# EAGLE design adapt_uart_serie (EAGLE 5.06)
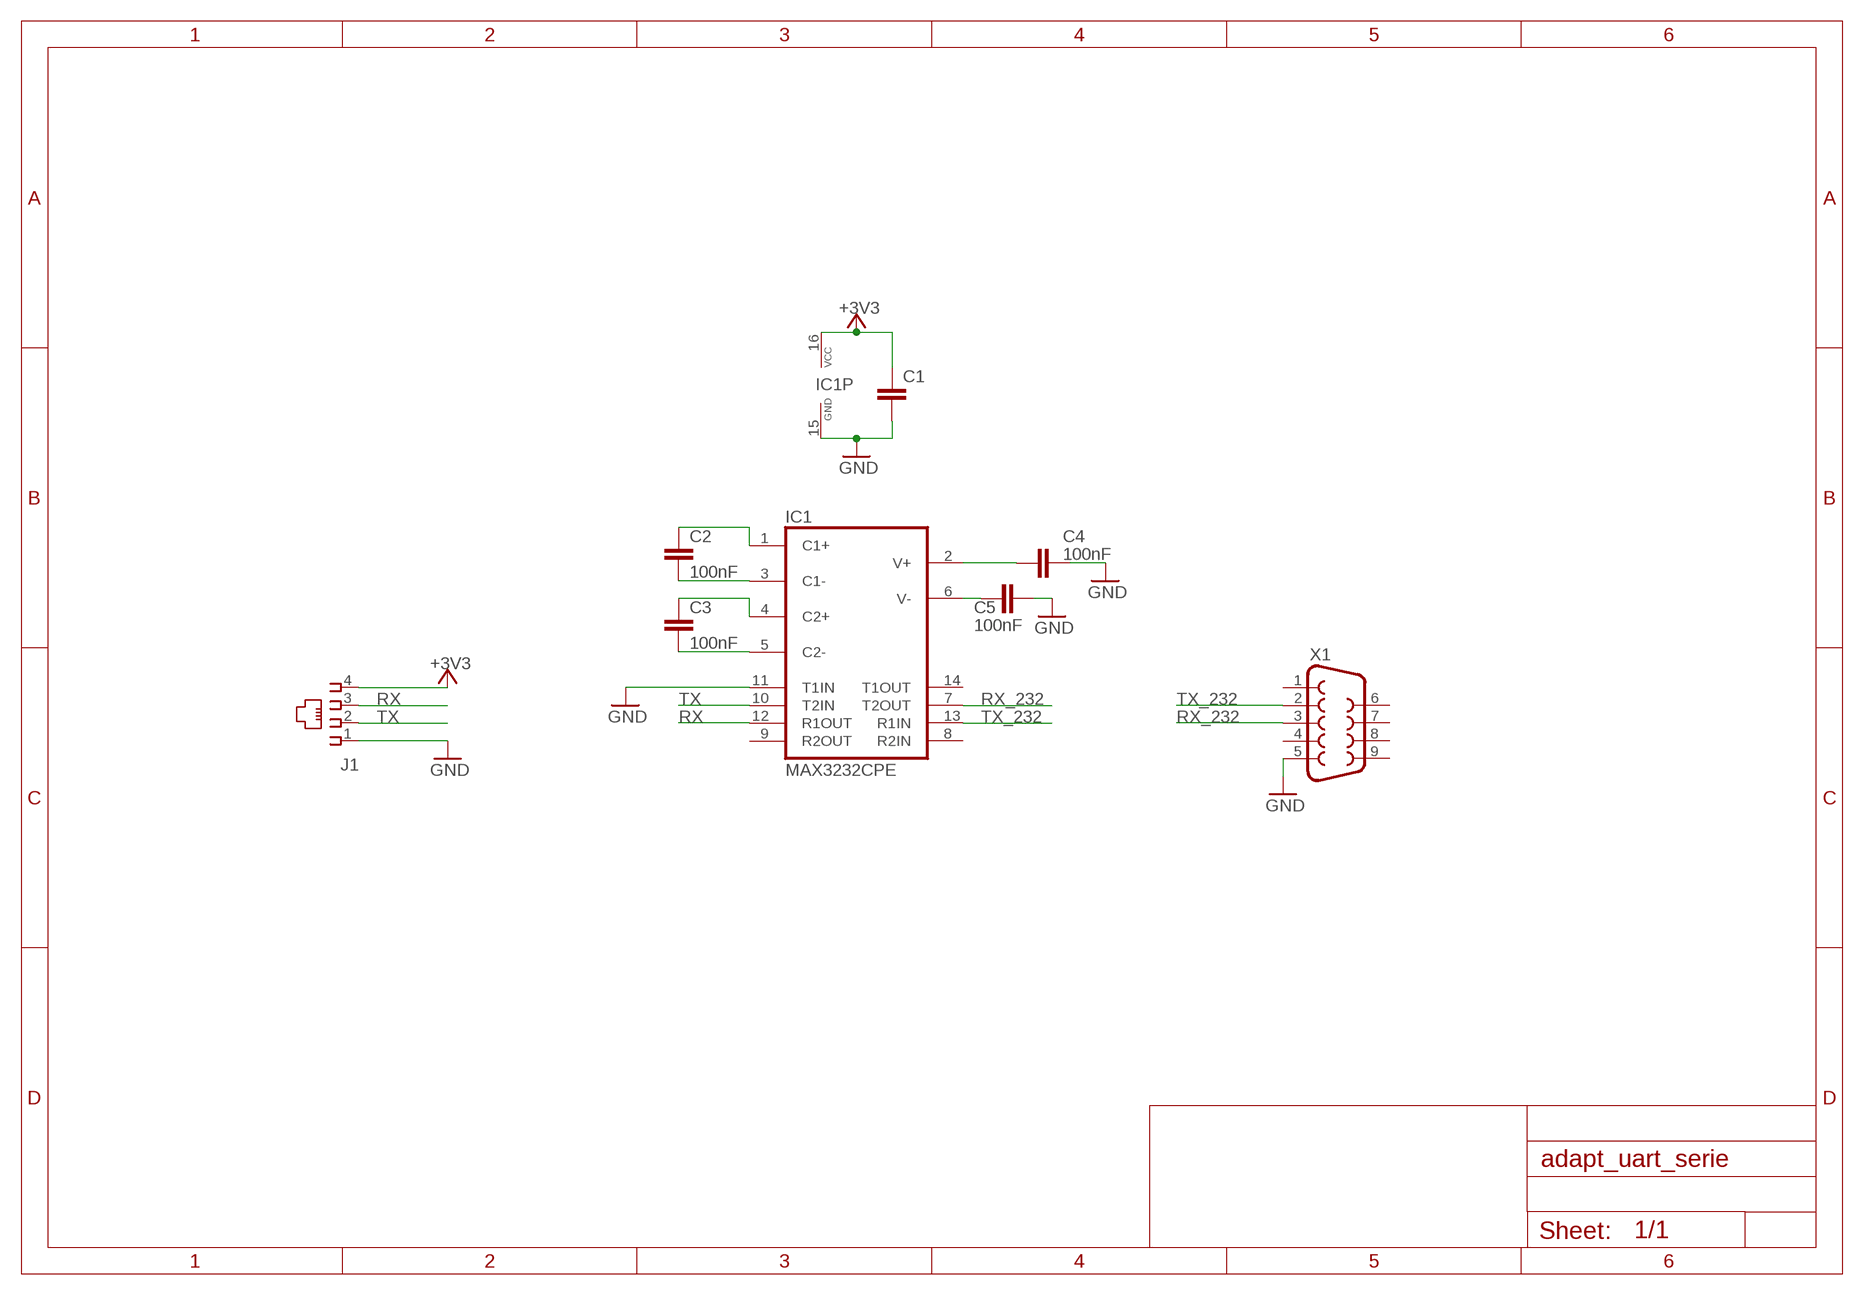
[diagram p0: schematic, sheet 1]

## Parts
C1  C-EUC0805  [C0805]
C2  100nF  C-EUC0805  [C0805]
C3  100nF  C-EUC0805  [C0805]
C4  100nF  C-EU025-025X050  [C025-025X050]
C5  100nF  C-EU025-024X044  [C025-024X044]
IC1  MAX3232CPE  [DIL16]
J1  520257-2  [520257-2]
X1  F09D  [F09D]

## Nets
+3V3: C1.1 IC1.16(VCC) J1.4
GND: C1.2 C4.2 C5.2 IC1.11(T1IN) IC1.15(GND) J1.1 X1.5
N$1: C5.1 IC1.6(V-)
N$2: C4.1 IC1.2(V+)
N$5: C3.1 IC1.4(C2+)
N$6: C3.2 IC1.5(C2-)
N$7: C2.2 IC1.3(C1-)
N$8: C2.1 IC1.1(C1+)
RX: IC1.12(R1OUT) J1.3
RX_232: IC1.7(T2OUT) X1.3
TX: IC1.10(T2IN) J1.2
TX_232: IC1.13(R1IN) X1.2
Unconnected: IC1.8(R2IN) IC1.9(R2OUT) IC1.14(T1OUT) X1.1 X1.4 X1.6 X1.7 X1.8 X1.9

## Library data of the parts
C1-C5 = rcl:C-EU: CAPACITOR, European symbol
IC1 = maxim:MAX3232*: True RS-232 Transceivers 3.0V to 5.5V, Low-Power up to 1Mbps, Using Four 0.1µF External Capacitors Source: http://pdfserv.maxim-ic.com/en/ds/MAX3222-MAX3241.pdf
J1 = con-amp:520257-2: AMP connector
X1 = con-subd:F09: SUB-D

## Board
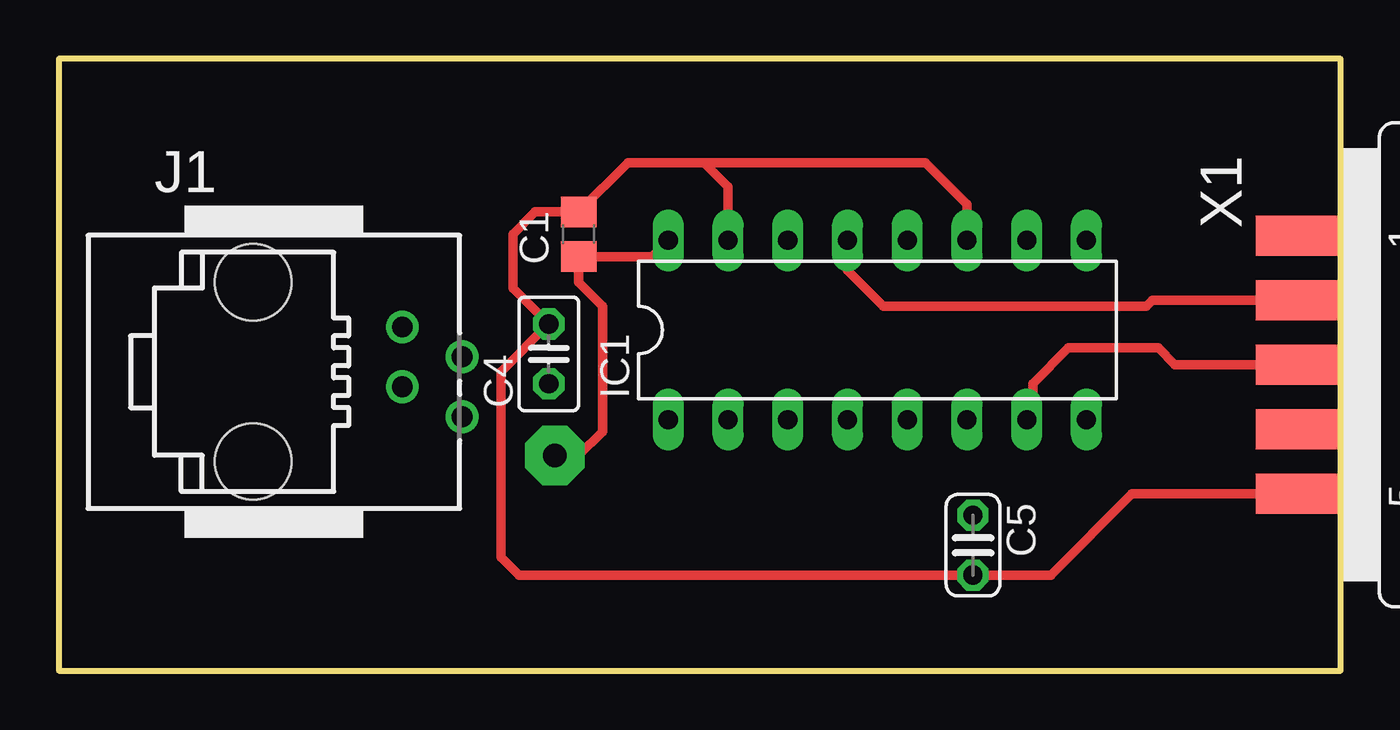
[diagram p1: board, top side]
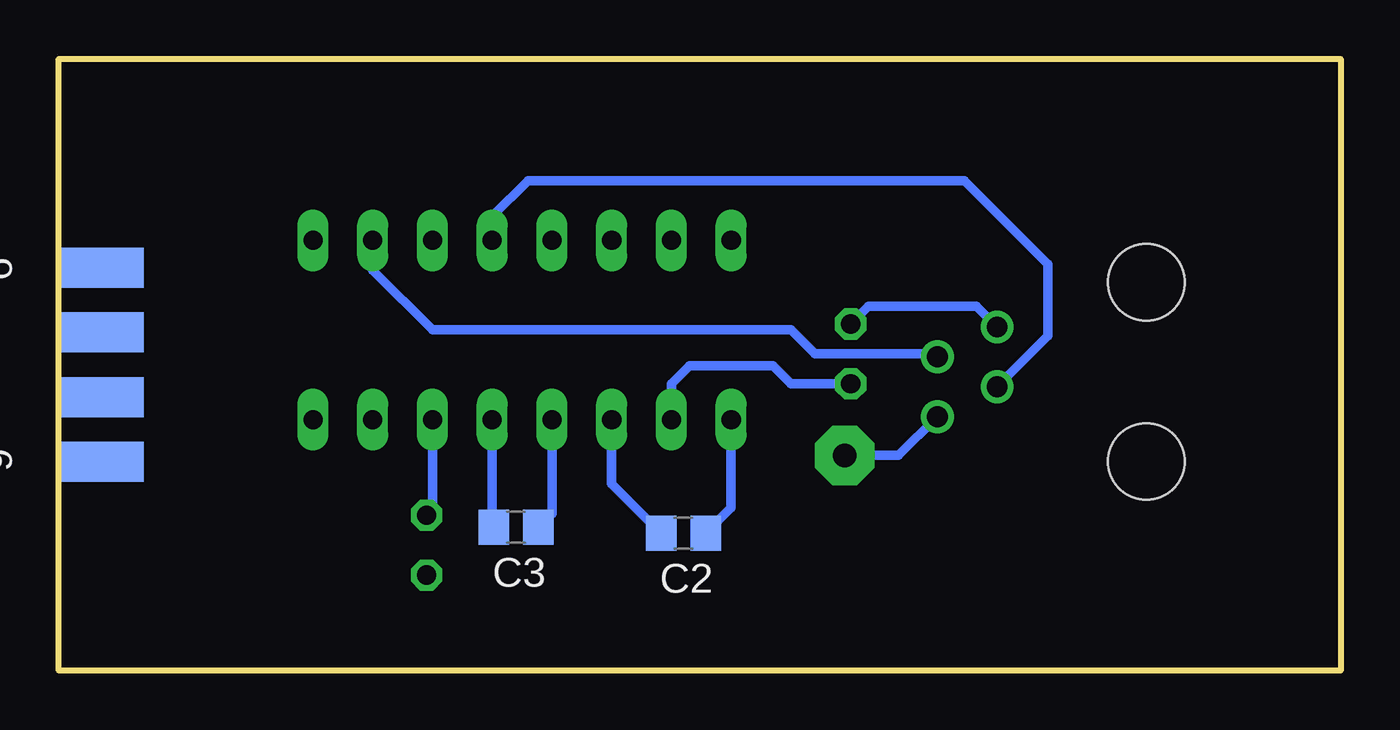
[diagram p2: board, bottom side, seen from below]

Size 54.49 x 26 mm. Coordinates in mm from the lower left corner, seen from the top.
Outline: 0,0 54.49,0 54.49,26 0,26 0,0
Copper layers (1*16): Top 0.035mm / dielectric 1.5mm / Bottom 0.035mm
Design rules "default *": minimum track width 10mil, minimum drill 24mil, track to track 0.4mm, track to pad 0.4mm, pad to pad 0.4mm, via to via 0.4mm, smd to smd 8mil, copper to edge 1mm, drill to drill 8mil, minimum pad ring 10mil, minimum via ring 8mil, stop-mask expansion 4mil, vias tented up to drill 0mil, thermal gap 10mil

### Footprints (pad centres in the part's own frame; a part is rotated, then mirrored left to right if it is on the bottom)
C0805 = smd 1.3 x 1.5: 1 -0.95,0; 2 0.95,0
C025-025X050 = drill 0.813 octagon: 1 -1.27,0; 2 1.27,0
C025-024X044 = drill 0.813 octagon: 1 -1.27,0; 2 1.27,0
DIL16 = drill 0.813 long: 1 -8.89,-3.81; 2 -6.35,-3.81; 3 -3.81,-3.81; 4 -1.27,-3.81; 5 1.27,-3.81; 6 3.81,-3.81; 7 6.35,-3.81; 8 8.89,-3.81; 9 8.89,3.81; 10 6.35,3.81; 11 3.81,3.81; 12 1.27,3.81; 13 -1.27,3.81; 14 -3.81,3.81; 15 -6.35,3.81; 16 -8.89,3.81
520257-2 = drill 0.889 round: 1 -1.905,5.461; 2 -0.635,8.001; 3 0.635,5.461; 4 1.905,8.001 | hole 3.251: -3.81,-0.889; 3.81,-0.889
F09D = smd 1.7 x 3.5: 1 -5.486,-6.045; 2 -2.743,-6.045; 3 0,-6.045; 4 2.743,-6.045; 5 5.486,-6.045 | smd 1.7 x 3.5 bottom: 6 -4.115,-6.045; 7 -1.372,-6.045; 8 1.372,-6.045; 9 4.115,-6.045

### Placement (x,y rotation side)
C1  22.1,18.54 90 top
C2  27.94,5.84 180 bottom
C3  35.05,6.1 180 bottom
C4  20.83,13.46 90 top
C5  38.86,5.33 270 top
IC1  34.8,14.48 0 top
J1  9.14,12.7 270 top
X1  58.67,13 270 top

### Tracks (layer width: path | path; a pad name or v marks a point on that pad's centre or on a via)
+3V3  (via drill 1 pad 2.54)
  Top 0.406: v21.08,9.14 22.1,9.14 23.11,10.16 23.11,15.49 22.1,16.51 C1.1 25.21,17.59 IC1.16
  Bottom 0.406: v21.08,9.14 18.8,9.14 J1.4
GND
  Top 0.406: 38.35,4.06 19.56,4.06 18.8,4.83 18.8,12.7 C4.2 19.3,16.26 19.3,18.54 20.25,19.49 C1.2 24.2,21.59 27.43,21.59 | 38.35,4.06 C5.2 | 38.35,4.06 42.16,4.06 45.61,7.51 X1.5 | 27.43,21.59 36.83,21.59 38.61,19.81 IC1.11 | IC1.15 28.45,20.57 27.43,21.59
  Bottom 0.406: J1.1 15.49,15.49 20.07,15.49 C4.2
N$1
  Bottom 0.406: C5.1 38.61,6.86 IC1.6
N$2
  Bottom 0.406: C4.1 23.37,12.19 24.13,12.95 27.69,12.95 28.45,12.19 IC1.2
N$5
  Bottom 0.406: C3.1 33.53,6.67 IC1.4
N$6
  Bottom 0.406: C3.2 36.07,6.16 IC1.5
N$7
  Bottom 0.406: C2.2 30.99,7.94 IC1.3
N$8
  Bottom 0.406: C2.1 25.91,6.92 IC1.1
RX
  Bottom 0.406: J1.3 12.45,14.22 12.45,17.27 16,20.83 34.54,20.83 36.07,19.3 IC1.12
RX_232
  Top 0.406: IC1.7 41.4,10.92 41.4,12.19 42.93,13.72 46.74,13.72 47.45,13 X1.3
TX
  Bottom 0.406: IC1.10 41.15,17.02 38.61,14.48 27.43,14.48 | 27.43,14.48 23.37,14.48 22.35,13.46 17.27,13.46 J1.2 | 27.43,14.48 27.94,14.48
TX_232
  Top 0.406: IC1.13 33.53,17.02 35.05,15.49 46.23,15.49 46.48,15.74 X1.2